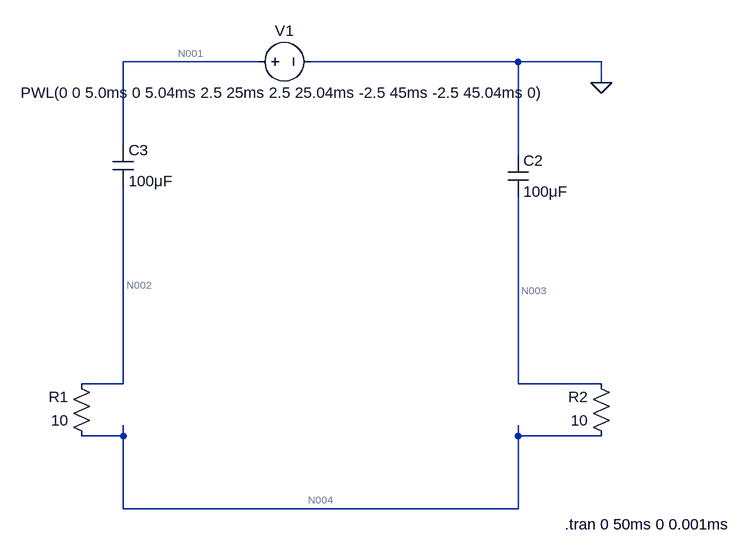
[diagram p0: schematic 電圧刺激等価回路_20210121_最小構成.asc]
電圧刺激等価回路_20210121_最小構成.asc, the LTspice schematic file:
Version 4
SHEET 1 1116 680
WIRE 336 -368 128 -368
WIRE 736 -368 416 -368
WIRE 864 -368 736 -368
WIRE 864 -336 864 -368
WIRE 128 -240 128 -368
WIRE 736 -224 736 -368
WIRE 128 128 128 -176
WIRE 128 128 64 128
WIRE 736 128 736 -160
WIRE 864 128 736 128
WIRE 128 208 128 192
WIRE 128 208 64 208
WIRE 736 208 736 192
WIRE 864 208 736 208
WIRE 128 320 128 208
WIRE 736 320 736 208
WIRE 736 320 128 320
FLAG 864 -336 0
SYMBOL cap 112 -240 R0
SYMATTR InstName C3
SYMATTR Value 100μF
SYMBOL voltage 320 -368 R270
WINDOW 0 32 56 VTop 2
WINDOW 3 -32 56 VBottom 2
WINDOW 123 0 0 Left 0
WINDOW 39 0 0 Left 0
SYMATTR InstName V1
SYMATTR Value PWL(0 0 5.0ms 0 5.04ms 2.5 25ms 2.5 25.04ms -2.5 45ms -2.5 45.04ms 0)
SYMBOL cap 720 -224 R0
SYMATTR InstName C2
SYMATTR Value 100μF
SYMBOL res 80 224 R180
WINDOW 0 36 76 Left 2
WINDOW 3 36 40 Left 2
SYMATTR InstName R1
SYMATTR Value 10
SYMBOL res 880 224 R180
WINDOW 0 36 76 Left 2
WINDOW 3 36 40 Left 2
SYMATTR InstName R2
SYMATTR Value 10
TEXT 808 344 Left 2 !.tran 0 50ms 0 0.001ms

The netlist it stands for:
* 電圧刺激等価回路_20210121_最小構成.asc
C3 N001 N002 100μF
V1 N001 0 PWL(0 0 5.0ms 0 5.04ms 2.5 25ms 2.5 25.04ms -2.5 45ms -2.5 45.04ms 0)
C2 0 N003 100μF
R1 N004 N002 10
R2 N004 N003 10
.tran 0 50ms 0 0.001ms
.backanno
.end

* Results of the author's LTspice run, read from the files saved beside the schematic
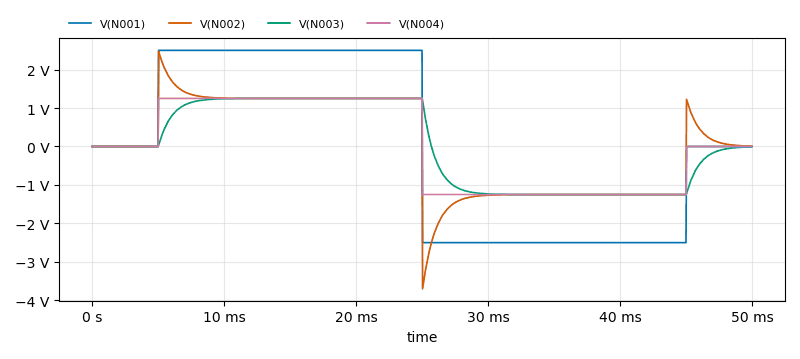
[diagram p1: Transient Analysis of 電圧刺激等価回路_20210121_最小構成.asc, plotted from the saved traces]
* Transient Analysis, 1 run:
*   V(N001): min -2.5 V, max 2.5 V, average 0 V, rms 2.235 V, last 0 V
*   V(N002): min -3.701 V, max 2.475 V, average -50.89 µV, rms 1.237 V, last 8.593 mV
*   V(N003): min -1.25 V, max 1.25 V, average 50.84 µV, rms 1.076 V, last -8.593 mV
*   V(N004): min -1.25 V, max 1.25 V, average 0 V, rms 1.118 V, last 0 V